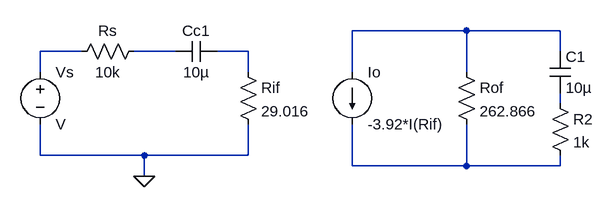
[diagram p0: schematic lab32.asc]
lab32.asc, the LTspice schematic file:
Version 4
SHEET 1 904 680
WIRE 704 176 528 176
WIRE 848 176 704 176
WIRE 112 208 48 208
WIRE 256 208 192 208
WIRE 368 208 320 208
WIRE 848 208 848 176
WIRE 48 240 48 208
WIRE 368 240 368 208
WIRE 528 240 528 176
WIRE 704 240 704 176
WIRE 848 288 848 272
WIRE 48 368 48 320
WIRE 208 368 48 368
WIRE 368 368 368 320
WIRE 368 368 208 368
WIRE 528 384 528 320
WIRE 704 384 704 320
WIRE 704 384 528 384
WIRE 848 384 848 368
WIRE 848 384 704 384
WIRE 208 400 208 368
FLAG 208 400 0
SYMBOL voltage 48 224 R0
SYMATTR InstName Vs
SYMBOL res 208 192 R90
WINDOW 0 0 56 VBottom 2
WINDOW 3 32 56 VTop 2
SYMATTR InstName Rs
SYMATTR Value 10k
SYMBOL res 352 224 R0
SYMATTR InstName Rif
SYMATTR Value 29.016
SYMBOL cap 320 192 R90
WINDOW 0 0 32 VBottom 2
WINDOW 3 32 32 VTop 2
SYMATTR InstName Cc1
SYMATTR Value 10µ
SYMBOL current 528 240 R0
SYMATTR InstName Io
SYMATTR Value -3.92*I(Rif)
SYMBOL res 688 224 R0
SYMATTR InstName Rof
SYMATTR Value 262.866
SYMBOL cap 832 208 R0
SYMATTR InstName C1
SYMATTR Value 10µ
SYMBOL res 832 272 R0
SYMATTR InstName R2
SYMATTR Value 1k

The netlist it stands for:
* lab32.asc
Vs N002 0 V
Rs N003 N002 10k
Rif N004 0 29.016
Cc1 N004 N003 10µ
Io N001 N006 -3.92*I(Rif)
Rof N001 N006 262.866
C1 N001 N005 10µ
R2 N005 N006 1k
.backanno
.end